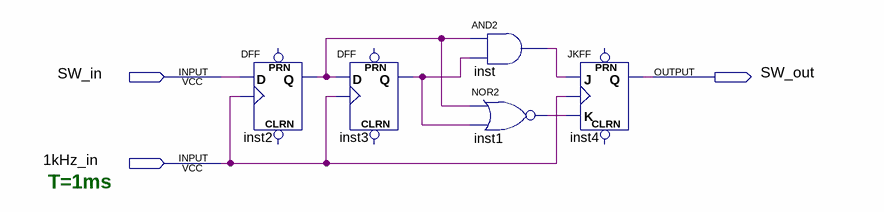
[diagram p0: schematic sheet]
// Quartus schematic debounce.bdf as structural Verilog: 5 symbols, 3 pins
module debounce (
  input  SW_in,
  input  \1kHz_in ,
  output SW_out
);

  wire inst1_out, inst2_q, inst3_q, inst_out;

  DFF inst2 (.CLK(\1kHz_in ), .D(SW_in), .Q(inst2_q));  // open: CLRN, PRN
  DFF inst3 (.CLK(\1kHz_in ), .D(inst2_q), .Q(inst3_q));  // open: CLRN, PRN
  and inst (inst_out, inst2_q, inst3_q);
  nor inst1 (inst1_out, inst2_q, inst3_q);
  JKFF inst4 (.K(inst1_out), .J(inst_out), .CLK(\1kHz_in ), .Q(SW_out));  // open: PRN, CLRN

  // Notes on the sheet:
  //   T=1ms
endmodule
